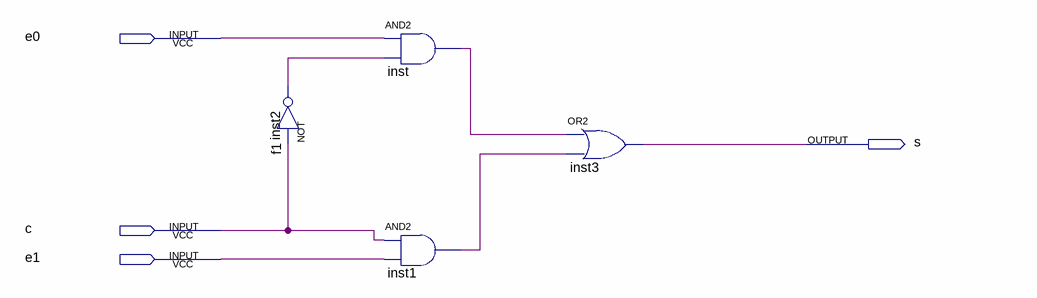
[diagram p0: schematic sheet]
// Quartus schematic bfs_mux_2x1_1bit.bdf as structural Verilog: 4 symbols, 4 pins
module bfs_mux_2x1_1bit (
  input  e0,
  input  c,
  input  e1,
  output s
);

  wire inst1_out, inst2_out, inst_out;

  not inst2 (inst2_out, c);
  and inst (inst_out, e0, inst2_out);
  and inst1 (inst1_out, c, e1);
  or inst3 (s, inst_out, inst1_out);

  // Other names for the same wires on the sheet: f1 = c
endmodule
